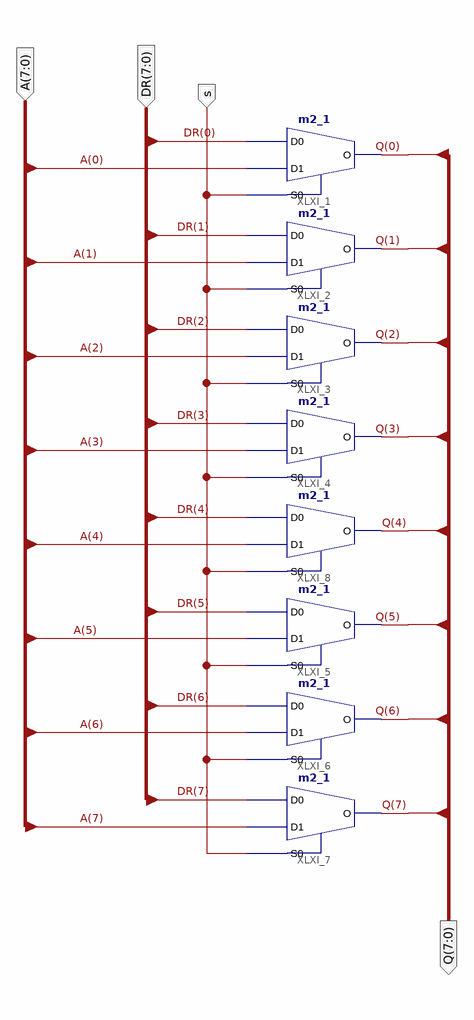
[diagram p0: schematic sheet 1]
// Xilinx ISE schematic muxR.sch (spartan3e) as structural Verilog: 8 symbols, 4 ports
module muxR (
  input  s,
  input  [7:0] DR,
  input  [7:0] A,
  output [7:0] Q
);

  m2_1 XLXI_2 (.D0(DR[1]), .D1(A[1]), .S0(s), .O(Q[1]));
  m2_1 XLXI_3 (.D0(DR[2]), .D1(A[2]), .S0(s), .O(Q[2]));
  m2_1 XLXI_4 (.D0(DR[3]), .D1(A[3]), .S0(s), .O(Q[3]));
  m2_1 XLXI_5 (.D0(DR[5]), .D1(A[5]), .S0(s), .O(Q[5]));
  m2_1 XLXI_6 (.D0(DR[6]), .D1(A[6]), .S0(s), .O(Q[6]));
  m2_1 XLXI_7 (.D0(DR[7]), .D1(A[7]), .S0(s), .O(Q[7]));
  m2_1 XLXI_8 (.D0(DR[4]), .D1(A[4]), .S0(s), .O(Q[4]));
  m2_1 XLXI_1 (.D0(DR[0]), .D1(A[0]), .S0(s), .O(Q[0]));
endmodule
